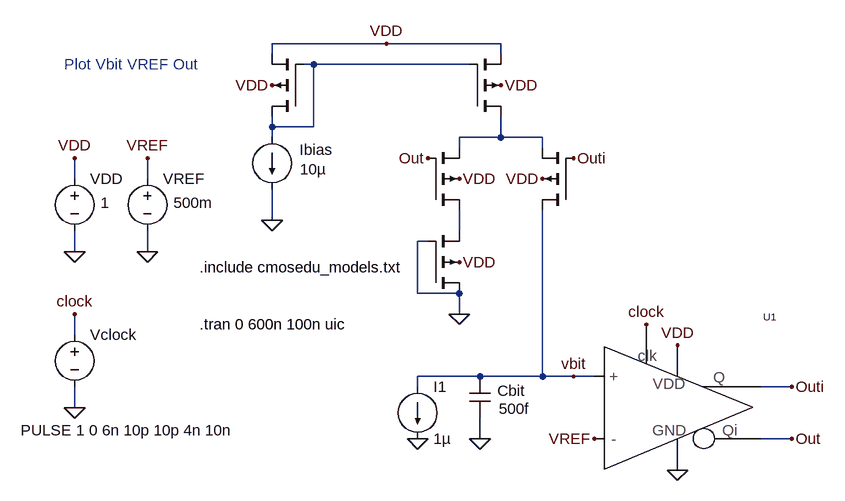
[diagram p0: schematic Fig17_6.asc]
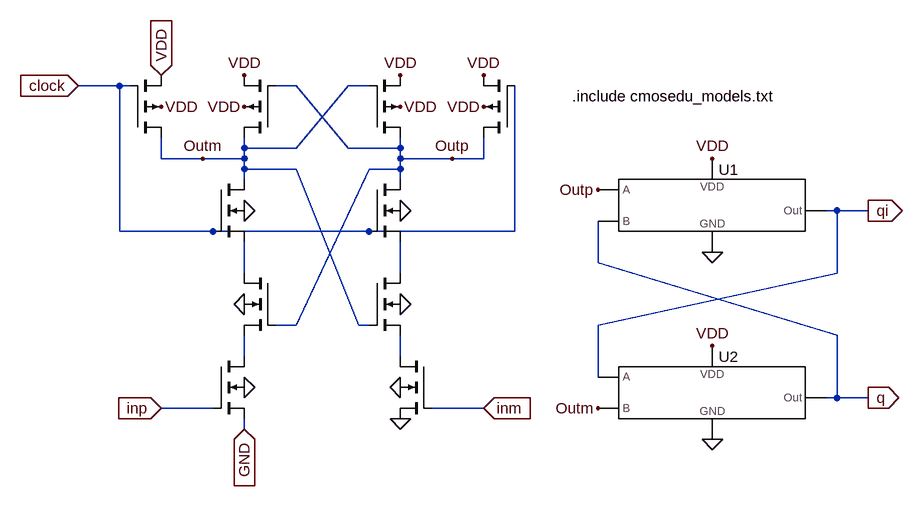
[diagram p1: sub-circuit fig_17_16_no_vos.asc]
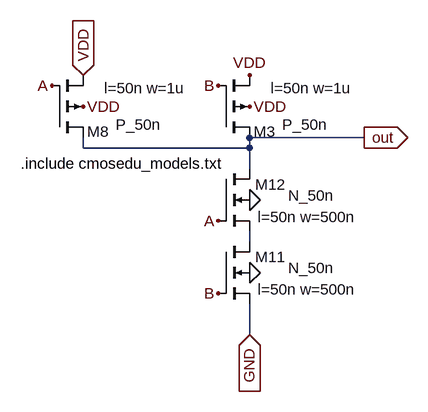
[diagram p2: sub-circuit nand_2.asc]
Fig17_6.asc, the LTspice schematic file:
Version 4
SHEET 1 1636 680
WIRE 944 -672 768 -672
WIRE 1120 -672 944 -672
WIRE 768 -656 768 -672
WIRE 1120 -656 1120 -672
WIRE 832 -640 816 -640
WIRE 1072 -640 832 -640
WIRE 768 -544 768 -560
WIRE 832 -544 832 -640
WIRE 832 -544 768 -544
WIRE 768 -528 768 -544
WIRE 1120 -528 1120 -560
WIRE 1120 -528 1056 -528
WIRE 1184 -528 1120 -528
WIRE 1056 -512 1056 -528
WIRE 1184 -512 1184 -528
WIRE 464 -464 464 -496
WIRE 576 -464 576 -496
WIRE 768 -400 768 -448
WIRE 1056 -384 1056 -416
WIRE 1008 -368 992 -368
WIRE 464 -352 464 -384
WIRE 576 -352 576 -384
WIRE 992 -288 992 -368
WIRE 1056 -288 992 -288
WIRE 1056 -256 1056 -288
WIRE 464 -224 464 -256
WIRE 1088 -160 992 -160
WIRE 1184 -160 1184 -416
WIRE 1184 -160 1088 -160
WIRE 1232 -160 1184 -160
WIRE 1264 -160 1232 -160
WIRE 992 -144 992 -160
WIRE 1568 -144 1520 -144
WIRE 464 -112 464 -144
WIRE 1088 -64 1088 -96
WIRE 1568 -64 1520 -64
FLAG 464 -352 0
FLAG 464 -496 VDD
FLAG 1056 -336 VDD
FLAG 1184 -464 VDD
FLAG 1232 -160 vbit
FLAG 576 -352 0
FLAG 576 -496 VREF
FLAG 1392 -208 VDD
FLAG 464 -112 0
FLAG 464 -256 clock
FLAG 1264 -64 VREF
FLAG 1088 -64 0
FLAG 1344 -240 clock
FLAG 1392 -16 0
FLAG 1568 -64 Out
FLAG 992 -64 0
FLAG 1568 -144 Outi
FLAG 1056 -464 VDD
FLAG 1056 -256 0
FLAG 1232 -496 Outi
FLAG 1008 -496 Out
FLAG 1120 -608 VDD
FLAG 768 -608 VDD
FLAG 768 -400 0
FLAG 944 -672 VDD
SYMBOL voltage 464 -480 R0
WINDOW 123 0 0 Left 0
WINDOW 39 0 0 Left 0
WINDOW 3 40 53 Left 0
SYMATTR Value 1
SYMATTR InstName VDD
SYMBOL pmos4 1008 -288 M180
WINDOW 0 56 32 Invisible 0
WINDOW 3 56 72 Invisible 0
SYMATTR InstName M3
SYMATTR Value P_50n
SYMATTR Value2 l=50n w=1u
SYMBOL pmos4 1232 -416 R180
WINDOW 0 56 32 Invisible 0
WINDOW 3 56 72 Invisible 0
SYMATTR InstName M1
SYMATTR Value P_50n
SYMATTR Value2 l=50n w=1u
SYMBOL voltage 576 -480 R0
WINDOW 123 0 0 Left 0
WINDOW 39 0 0 Left 0
WINDOW 3 40 53 Left 0
SYMATTR Value 500m
SYMATTR InstName VREF
SYMBOL voltage 464 -240 R0
WINDOW 123 0 0 Left 0
WINDOW 39 0 0 Left 0
WINDOW 3 -83 163 Left 0
SYMATTR Value PULSE 1 0 6n 10p 10p 4n 10n
SYMATTR InstName Vclock
SYMBOL cap 1072 -160 R0
WINDOW 0 43 22 Left 0
WINDOW 3 45 50 Left 0
SYMATTR InstName Cbit
SYMATTR Value 500f
SYMBOL Fig_17_16_no_Vos 1312 -112 R0
SYMATTR InstName U1
SYMBOL current 992 -144 R0
WINDOW 123 0 0 Left 0
WINDOW 39 0 0 Left 0
SYMATTR InstName I1
SYMATTR Value 1µ
SYMBOL pmos4 1008 -416 M180
WINDOW 0 56 32 Invisible 0
WINDOW 3 56 72 Invisible 0
SYMATTR InstName M2
SYMATTR Value P_50n
SYMATTR Value2 l=50n w=1u
SYMBOL current 768 -528 R0
WINDOW 0 42 19 Left 0
WINDOW 3 43 49 Left 0
WINDOW 123 0 0 Left 0
WINDOW 39 0 0 Left 0
SYMATTR InstName Ibias
SYMATTR Value 10µ
SYMBOL pmos4 1072 -560 M180
WINDOW 0 56 32 Invisible 0
WINDOW 3 56 72 Invisible 0
SYMATTR InstName M4
SYMATTR Value P_50n
SYMATTR Value2 l=50n w=1u
SYMBOL pmos4 816 -560 R180
WINDOW 0 56 32 Invisible 0
WINDOW 3 56 72 Invisible 0
SYMATTR InstName M5
SYMATTR Value P_50n
SYMATTR Value2 l=50n w=1u
TEXT 656 -328 Left 0 !.include cmosedu_models.txt
TEXT 656 -240 Left 0 !.tran 0 600n 100n uic
TEXT 448 -640 Left 0 ;Plot Vbit VREF Out

fig_17_16_no_vos.asc, the sub-circuit schematic file:
Version 4
SHEET 1 1760 680
WIRE 528 -560 464 -560
WIRE 544 -560 528 -560
WIRE 800 -560 768 -560
WIRE 912 -560 880 -560
WIRE 720 -464 720 -480
WIRE 800 -464 880 -560
WIRE 800 -464 720 -464
WIRE 880 -464 800 -560
WIRE 960 -464 960 -480
WIRE 960 -464 880 -464
WIRE 592 -448 592 -480
WIRE 656 -448 592 -448
WIRE 720 -448 720 -464
WIRE 720 -448 656 -448
WIRE 960 -448 960 -464
WIRE 1040 -448 960 -448
WIRE 1088 -448 1088 -480
WIRE 1088 -448 1040 -448
WIRE 720 -432 720 -448
WIRE 800 -432 720 -432
WIRE 960 -432 960 -448
WIRE 960 -432 912 -432
WIRE 720 -416 720 -432
WIRE 960 -416 960 -432
WIRE 1632 -368 1616 -368
WIRE 1680 -368 1632 -368
WIRE 528 -336 528 -560
WIRE 672 -336 528 -336
WIRE 912 -336 672 -336
WIRE 1136 -336 1136 -560
WIRE 1136 -336 912 -336
WIRE 1264 -288 1264 -352
WIRE 720 -272 720 -320
WIRE 960 -272 960 -320
WIRE 1632 -272 1632 -368
WIRE 800 -192 912 -432
WIRE 800 -192 768 -192
WIRE 896 -192 800 -432
WIRE 912 -192 896 -192
WIRE 1264 -192 1632 -272
WIRE 1632 -176 1264 -288
WIRE 720 -144 720 -176
WIRE 960 -144 960 -176
WIRE 1264 -112 1264 -192
WIRE 1632 -80 1632 -176
WIRE 1632 -80 1616 -80
WIRE 1680 -80 1632 -80
WIRE 672 -64 592 -64
WIRE 1088 -64 1008 -64
WIRE 720 -32 720 -48
FLAG 720 -96 0
FLAG 720 -528 VDD
FLAG 960 -528 VDD
FLAG 720 -576 VDD
FLAG 960 -576 VDD
FLAG 960 -224 0
FLAG 720 -224 0
FLAG 592 -528 VDD
FLAG 1088 -528 VDD
FLAG 1088 -576 VDD
FLAG 720 -368 0
FLAG 960 -368 0
FLAG 960 -96 0
FLAG 960 -48 0
FLAG 1040 -448 Outp
FLAG 656 -448 Outm
FLAG 1440 -304 0
FLAG 1440 -16 0
FLAG 1440 -448 VDD
FLAG 1440 -160 VDD
FLAG 1264 -400 Outp
FLAG 1264 -64 Outm
FLAG 592 -64 inp
IOPIN 592 -64 In
FLAG 1088 -64 inm
IOPIN 1088 -64 In
FLAG 464 -560 clock
IOPIN 464 -560 In
FLAG 1680 -368 qi
IOPIN 1680 -368 Out
FLAG 1680 -80 q
IOPIN 1680 -80 Out
FLAG 592 -576 VDD
IOPIN 592 -576 In
FLAG 720 -32 GND
IOPIN 720 -32 In
SYMBOL nmos4 672 -144 R0
WINDOW 0 104 24 Invisible 0
WINDOW 3 179 41 Invisible 0
SYMATTR InstName M1
SYMATTR Value N_50n
SYMATTR Value2 l=50n w=500n
SYMBOL pmos4 768 -480 R180
WINDOW 0 56 32 Invisible 0
WINDOW 3 56 72 Invisible 0
SYMATTR InstName M2
SYMATTR Value P_50n
SYMATTR Value2 l=50n w=1u
SYMBOL pmos4 912 -480 M180
WINDOW 0 56 32 Invisible 0
WINDOW 3 56 72 Invisible 0
SYMATTR InstName M3
SYMATTR Value P_50n
SYMATTR Value2 l=50n w=1u
SYMBOL nmos4 912 -272 R0
WINDOW 0 104 24 Invisible 0
WINDOW 3 179 41 Invisible 0
SYMATTR InstName M5
SYMATTR Value N_50n
SYMATTR Value2 l=50n w=500n
SYMBOL nmos4 768 -272 M0
WINDOW 0 104 24 Invisible 0
WINDOW 3 179 41 Invisible 0
SYMATTR InstName M6
SYMATTR Value N_50n
SYMATTR Value2 l=50n w=500n
SYMBOL pmos4 544 -480 M180
WINDOW 0 56 32 Invisible 0
WINDOW 3 56 72 Invisible 0
SYMATTR InstName M4
SYMATTR Value P_50n
SYMATTR Value2 l=50n w=1u
SYMBOL pmos4 1136 -480 R180
WINDOW 0 56 32 Invisible 0
WINDOW 3 56 72 Invisible 0
SYMATTR InstName M7
SYMATTR Value P_50n
SYMATTR Value2 l=50n w=1u
SYMBOL nmos4 672 -416 R0
WINDOW 0 104 24 Invisible 0
WINDOW 3 179 41 Invisible 0
SYMATTR InstName M8
SYMATTR Value N_50n
SYMATTR Value2 l=50n w=500n
SYMBOL nmos4 912 -416 R0
WINDOW 0 104 24 Invisible 0
WINDOW 3 179 41 Invisible 0
SYMATTR InstName M9
SYMATTR Value N_50n
SYMATTR Value2 l=50n w=500n
SYMBOL nmos4 1008 -144 M0
WINDOW 0 104 24 Invisible 0
WINDOW 3 179 41 Invisible 0
SYMATTR InstName M10
SYMATTR Value N_50n
SYMATTR Value2 l=50n w=500n
SYMBOL NAND_2 1216 -352 R0
SYMATTR InstName U1
SYMBOL NAND_2 1216 -64 R0
SYMATTR InstName U2
TEXT 1224 -544 Left 0 !.include cmosedu_models.txt

nand_2.asc, the sub-circuit schematic file:
Version 4
SHEET 1 6288 680
WIRE 1344 -416 1168 -416
WIRE 912 -400 912 -416
WIRE 1168 -400 1168 -416
WIRE 1168 -400 912 -400
WIRE 1168 -368 1168 -400
WIRE 1168 -256 1168 -272
WIRE 1168 -112 1168 -160
FLAG 1168 -464 VDD
FLAG 912 -464 VDD
FLAG 1168 -208 0
FLAG 1168 -320 0
FLAG 1168 -512 VDD
FLAG 912 -512 VDD
IOPIN 912 -512 In
FLAG 1168 -112 GND
IOPIN 1168 -112 In
FLAG 1344 -416 out
IOPIN 1344 -416 Out
FLAG 864 -496 A
FLAG 1120 -288 A
FLAG 1120 -496 B
FLAG 1120 -176 B
SYMBOL pmos4 1120 -416 M180
WINDOW 0 88 9 Right 0
WINDOW 3 168 20 Right 0
WINDOW 123 206 76 Right 0
SYMATTR InstName M3
SYMATTR Value P_50n
SYMATTR Value2 l=50n w=1u
SYMBOL pmos4 864 -416 M180
WINDOW 0 88 9 Right 0
WINDOW 3 168 20 Right 0
WINDOW 123 206 76 Right 0
SYMATTR InstName M8
SYMATTR Value P_50n
SYMATTR Value2 l=50n w=1u
SYMBOL nmos4 1120 -256 R0
WINDOW 0 104 24 Right 0
WINDOW 3 179 41 Right 0
WINDOW 123 213 74 Right 0
SYMATTR InstName M11
SYMATTR Value N_50n
SYMATTR Value2 l=50n w=500n
SYMBOL nmos4 1120 -368 R0
WINDOW 0 104 24 Right 0
WINDOW 3 179 41 Right 0
WINDOW 123 213 74 Right 0
SYMATTR InstName M12
SYMATTR Value N_50n
SYMATTR Value2 l=50n w=500n
TEXT 816 -376 Left 0 !.include cmosedu_models.txt

The netlist it stands for:
* Fig17_6.asc
VDD VDD 0 1
M3 0 0 N003 VDD P_50n l=50n w=1u
M1 vbit Outi N002 VDD P_50n l=50n w=1u
VREF VREF 0 500m
Vclock clock 0 PULSE 1 0 6n 10p 10p 4n 10n
Cbit vbit 0 500f
XU1 vbit VREF Outi Out clock VDD 0 fig_17_16_no_vos
I1 vbit 0 1µ
M2 N003 Out N002 VDD P_50n l=50n w=1u
Ibias N001 0 10µ
M4 N002 N001 VDD VDD P_50n l=50n w=1u
M5 N001 N001 VDD VDD P_50n l=50n w=1u

* block symbol definitions
.subckt fig_17_16_no_vos inp inm q qi clock VDD GND
M1 N003 inp GND 0 N_50n l=50n w=500n
M2 Outm Outp VDD VDD P_50n l=50n w=1u
M3 Outp Outm VDD VDD P_50n l=50n w=1u
M5 N002 Outm N004 0 N_50n l=50n w=500n
M6 N001 Outp N003 0 N_50n l=50n w=500n
M4 Outm clock VDD VDD P_50n l=50n w=1u
M7 Outp clock VDD VDD P_50n l=50n w=1u
M8 Outm clock N001 0 N_50n l=50n w=500n
M9 Outp clock N002 0 N_50n l=50n w=500n
M10 N004 inm 0 0 N_50n l=50n w=500n
XU1 Outp q qi VDD 0 nand_2
XU2 qi Outm q VDD 0 nand_2
.include cmosedu_models.txt
.ends fig_17_16_no_vos

.subckt nand_2 A B Out VDD GND
M3 out B VDD VDD P_50n l=50n w=1u
M8 out A VDD VDD P_50n l=50n w=1u
M11 N001 B GND 0 N_50n l=50n w=500n
M12 out A N001 0 N_50n l=50n w=500n
.include cmosedu_models.txt
.ends nand_2

.model NMOS NMOS
.model PMOS PMOS
.lib standard.mos
.include cmosedu_models.txt
.tran 0 600n 100n uic
* Plot Vbit VREF Out
.backanno
.end